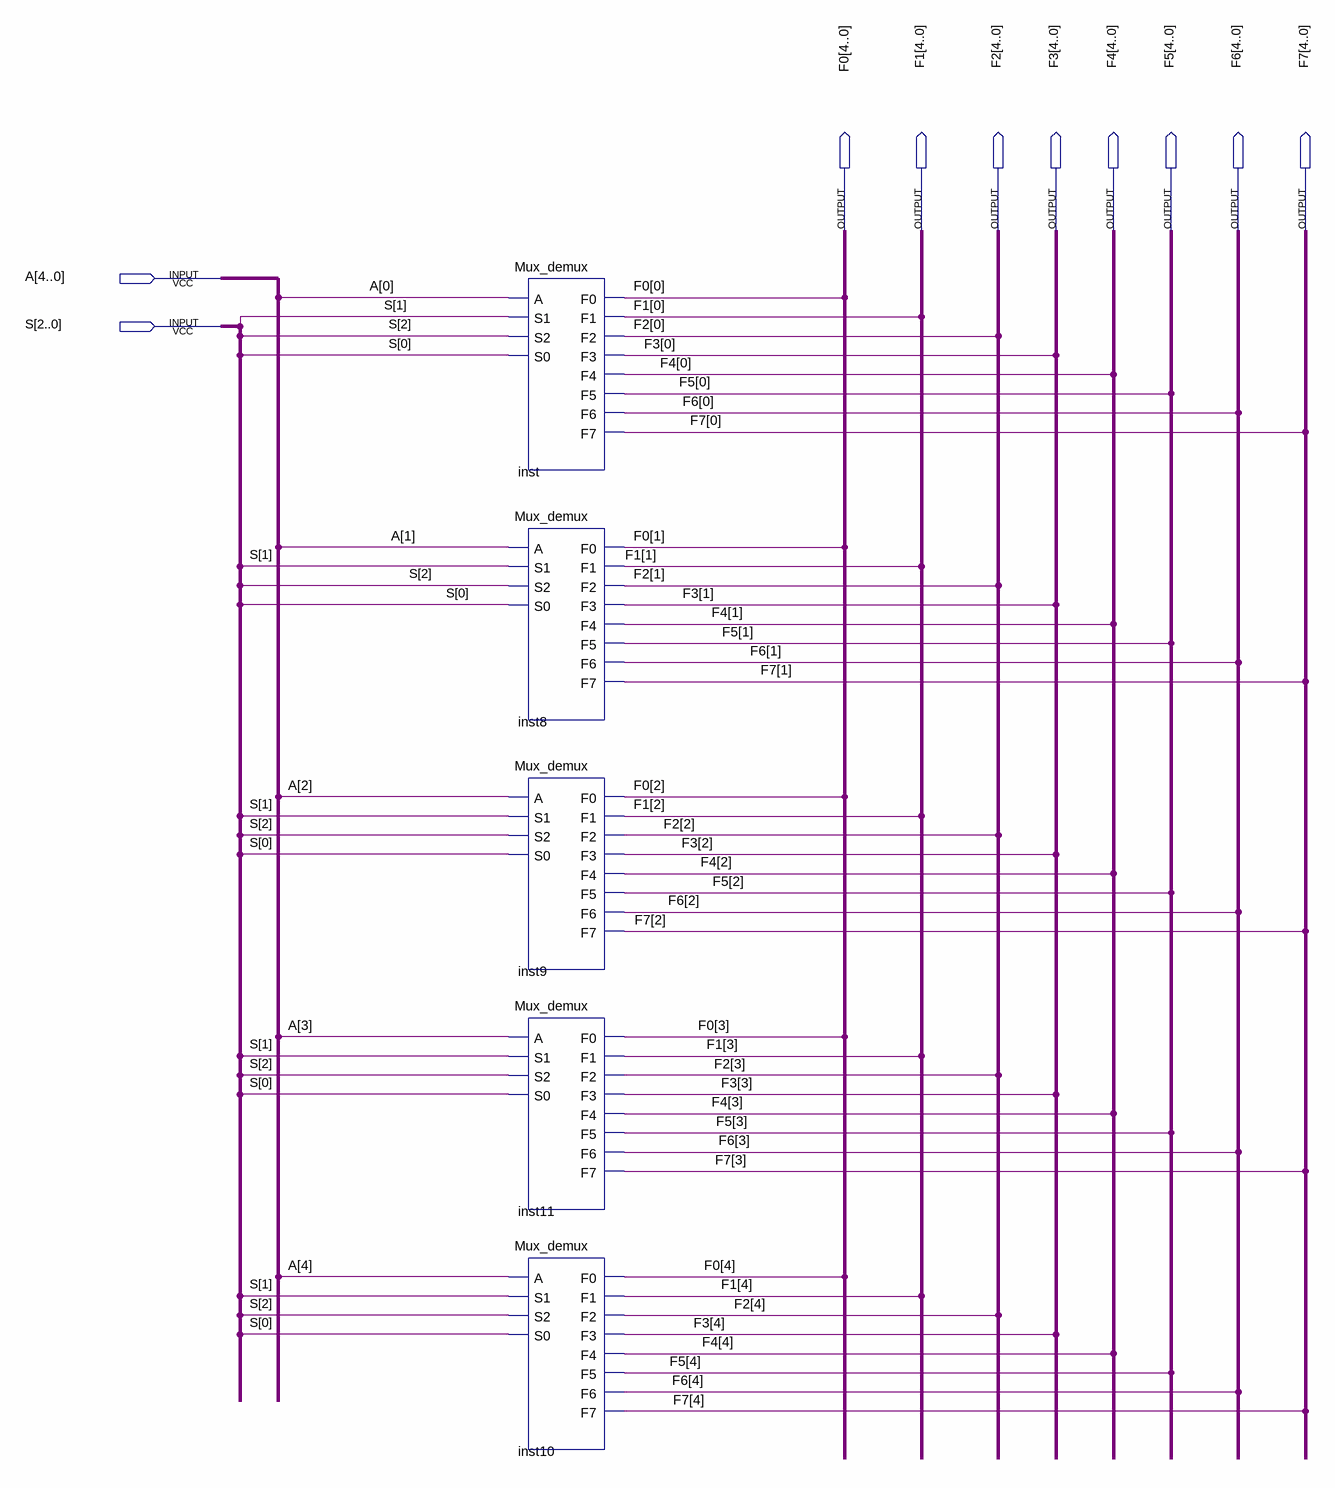
[diagram p0: schematic sheet]
// Quartus schematic Demux_maior.bdf as structural Verilog: 5 symbols, 10 pins
module Demux_maior (
  input  [4:0] A,
  input  [2:0] S,
  output [4:0] F0,
  output [4:0] F1,
  output [4:0] F2,
  output [4:0] F3,
  output [4:0] F4,
  output [4:0] F5,
  output [4:0] F6,
  output [4:0] F7
);

  Mux_demux inst (
    .A(A[0]), .S1(S[1]), .S2(S[2]), .S0(S[0]), .F0(F0[0]), .F1(F1[0]), .F2(F2[0]), .F3(F3[0]), .F4(F4[0]),
    .F5(F5[0]), .F6(F6[0]), .F7(F7[0]));
  Mux_demux inst8 (
    .A(A[1]), .S1(S[1]), .S2(S[2]), .S0(S[0]), .F0(F0[1]), .F1(F1[1]), .F2(F2[1]), .F3(F3[1]), .F4(F4[1]),
    .F5(F5[1]), .F6(F6[1]), .F7(F7[1]));
  Mux_demux inst9 (
    .A(A[2]), .S1(S[1]), .S2(S[2]), .S0(S[0]), .F0(F0[2]), .F1(F1[2]), .F2(F2[2]), .F3(F3[2]), .F4(F4[2]),
    .F5(F5[2]), .F6(F6[2]), .F7(F7[2]));
  Mux_demux inst11 (
    .A(A[3]), .S1(S[1]), .S2(S[2]), .S0(S[0]), .F0(F0[3]), .F1(F1[3]), .F2(F2[3]), .F3(F3[3]), .F4(F4[3]),
    .F5(F5[3]), .F6(F6[3]), .F7(F7[3]));
  Mux_demux inst10 (
    .A(A[4]), .S1(S[1]), .S2(S[2]), .S0(S[0]), .F0(F0[4]), .F1(F1[4]), .F2(F2[4]), .F3(F3[4]), .F4(F4[4]),
    .F5(F5[4]), .F6(F6[4]), .F7(F7[4]));
endmodule
